# Altium schematic sheet Sheet1.SchDoc
size A4
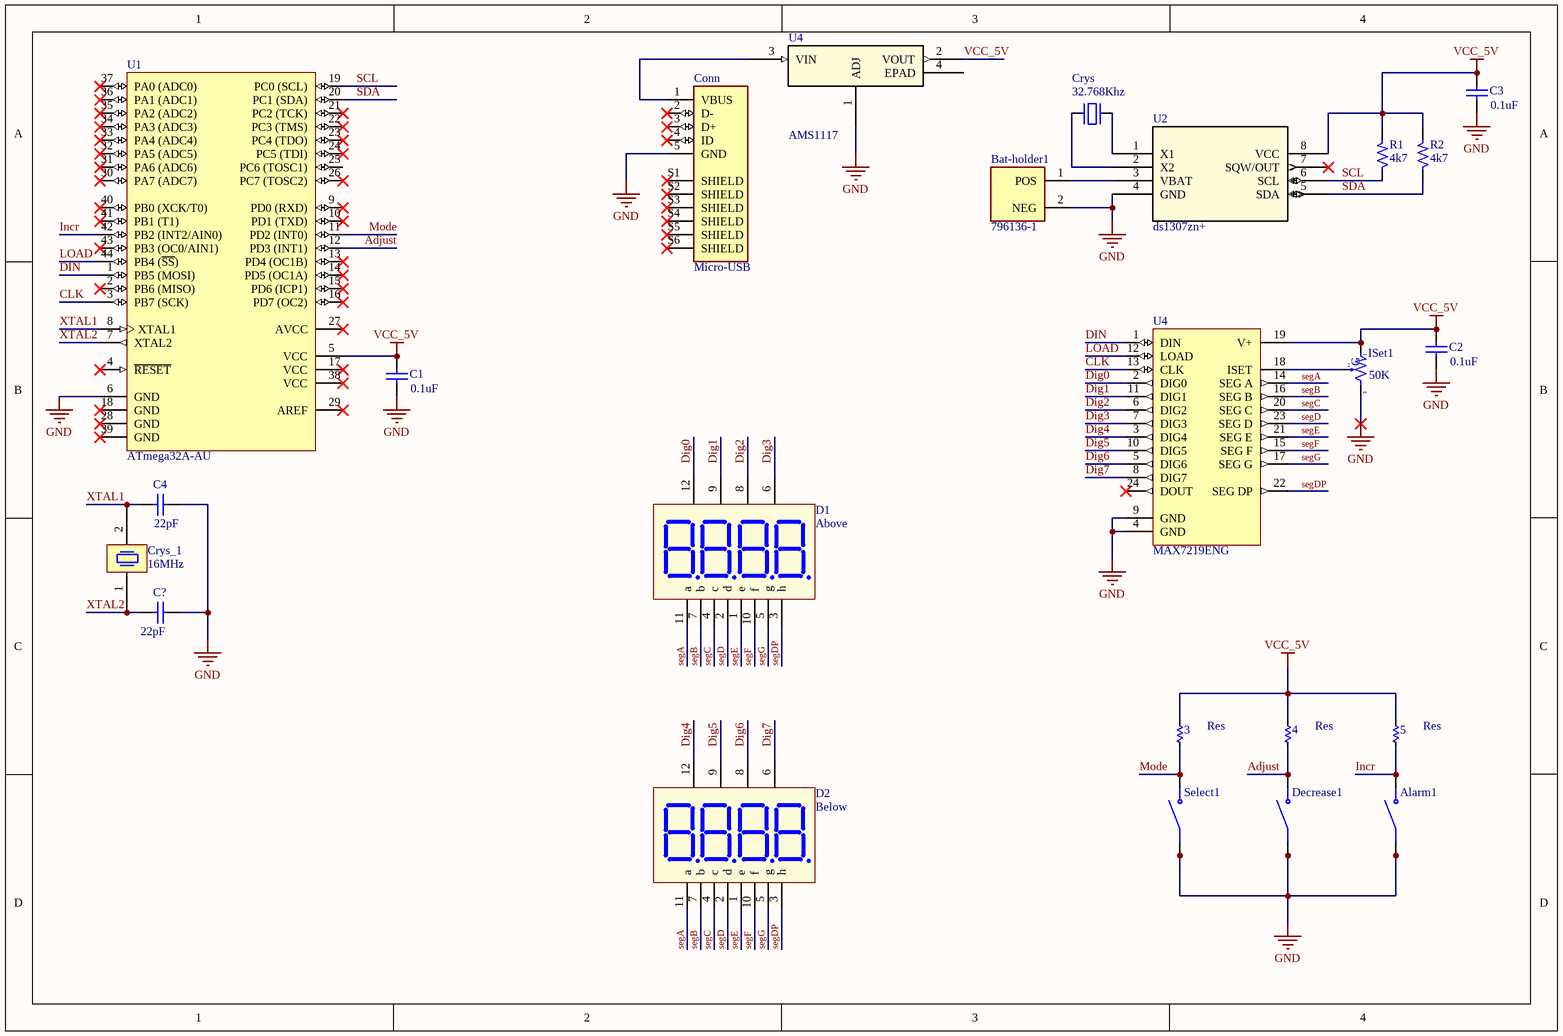
[diagram p0: Sheet1.SchDoc]

## Parts
(Parts that share a designator on the sheet are numbered #1, #2 ... from top to bottom, then left to right.)
3  Res  [RES-SMD-1206]
4  Res  [RES-SMD-1206]
5  Res  [RES-SMD-1206]
Alarm1  1571527-1  [SW_1571527-1]  (value not drawn)
Bat-holder1  796136-1  [TE_796136-1]
C1  0.1uF  [C0805]
C2  0.1uF  [C0805]
C3  0.1uF  [C0805]
C4  22pF  [C0805]
C?  22pF  [C0805]
Conn  Micro-USB  [MOLEX_47346-0001]
Crys  32.768Khz  [XT32k]
Crys_1  16MHz  [ABLS2-8.000MHZ-D4Y-T]
D1  Above  [7SEGQ]
D2  Below  [7SEGQ]
Decrease1  1571527-1  [SW_1571527-1]  (value not drawn)
ISet1  50K  [VR-S1]
R1  4k7  [SM-RES-1206]
R2  4k7  [SM-RES-1206]
Select1  1571527-1  [SW_1571527-1]  (value not drawn)
U1  ATmega32A-AU  [TQFP44]
U2  ds1307zn+  [21-0041B_8_MXM]
U4#1  AMS1117  [SOT_AMS_ADS]
U4#2  MAX7219ENG  [SO24]

## Nets
GND: Alarm1.1(COM) Alarm1.2(COM) Bat-holder1.2(NEG) C1.1 C2.1 C3.1 C4.2 C?.2 Conn.5(GND) Decrease1.1(COM) Decrease1.2(COM) ISet1.3 Select1.1(COM) Select1.2(COM) U1.6(GND) U2.4(GND) U4#1.1(ADJ) U4#2.4(GND) U4#2.9(GND)
VCC_5V: 3.1 4.1 5.1 C1.2 C2.2 C3.2 ISet1.1 R1.2 R2.2 U1.5(VCC) U2.8(VCC) U4#1.2(VOUT) U4#2.19(V+)
Adjust: 4.2 Decrease1.3(NO) Decrease1.4(NO) U1.12(PD3_(INT1))
CLK: U1.3(PB7_(SCK)) U4#2.13(CLK)
Dig0: D1.12(V1) U4#2.2(DIG0)
Dig1: D1.9(V2) U4#2.11(DIG1)
Dig2: D1.8(V3) U4#2.6(DIG2)
Dig3: D1.6(V4) U4#2.7(DIG3)
Dig4: D2.12(V1) U4#2.3(DIG4)
Dig5: D2.9(V2) U4#2.10(DIG5)
Dig6: D2.8(V3) U4#2.5(DIG6)
Dig7: D2.6(V4) U4#2.8(DIG7)
DIN: U1.1(PB5_(MOSI)) U4#2.1(DIN)
Incr: 5.2 Alarm1.3(NO) Alarm1.4(NO) U1.42(PB2_(INT2/AIN0))
LOAD: U1.44(PB4_(~{SS})) U4#2.12(LOAD)
Mode: 3.2 Select1.3(NO) Select1.4(NO) U1.11(PD2_(INT0))
SCL: R1.1 U1.19(PC0_(SCL)) U2.6(SCL)
SDA: R2.1 U1.20(PC1_(SDA)) U2.5(SDA)
segA: D1.11(a) D2.11(a) U4#2.14(SEG_A)
segB: D1.7(b) D2.7(b) U4#2.16(SEG_B)
segC: D1.4(c) D2.4(c) U4#2.20(SEG_C)
segD: D1.2(d) D2.2(d) U4#2.23(SEG_D)
segDP: D1.3(h) D2.3(h) U4#2.22(SEG_DP)
segE: D1.1(e) D2.1(e) U4#2.21(SEG_E)
segF: D1.10(f) D2.10(f) U4#2.15(SEG_F)
segG: D1.5(g) D2.5(g) U4#2.17(SEG_G)
XTAL1: C4.1 Crys_1.2 U1.8(XTAL1)
XTAL2: C?.1 Crys_1.1 U1.7(XTAL2)
NetBat-holder1_1: Bat-holder1.1(POS) U2.3(VBAT)
NetConn_1: Conn.1(VBUS) U4#1.3(VIN)
NetCrys_1: Crys.1 U2.2(X2)
NetCrys_2: Crys.2 U2.1(X1)
NetISet1_2: ISet1.2 U4#2.18(ISET)

Not connected (* = marked no-connect by the designer): Conn 2(D-)* 3(D+)* 4(ID)* S1(SHIELD)* S2(SHIELD)* S3(SHIELD)* S4(SHIELD)* S5(SHIELD)* S6(SHIELD)*; U1 2(PB6_(MISO))* 4(~{RESET})* 9(PD0_(RXD))* 10(PD1_(TXD))* 13(PD4_(OC1B))* 14(PD5_(OC1A))* 15(PD6_(ICP1))* 16(PD7_(OC2))* 17(VCC)* 18(GND)* 21(PC2_(TCK))* 22(PC3_(TMS))* 23(PC4_(TDO))* 24(PC5_(TDI))* 25(PC6_(TOSC1)) 26(PC7_(TOSC2))* 27(AVCC)* 28(GND)* 29(AREF)* 30(PA7_(ADC7))* 31(PA6_(ADC6))* 32(PA5_(ADC5))* 33(PA4_(ADC4))* 34(PA3_(ADC3))* 35(PA2_(ADC2))* 36(PA1_(ADC1))* 37(PA0_(ADC0))* 38(VCC)* 39(GND)* 40(PB0_(XCK/T0))* 41(PB1_(T1))* 43(PB3_(OC0/AIN1))*; U2 7(SQW/OUT)*; U4#1 4(EPAD); U4#2 24(DOUT)*

## Notes on the sheet
- (in symbol VR-S) G

## Library data of the parts
3-5 = Res-SMD: Resistor; Manufacturer: Generic Components; Class: Passive; Published: 08/06/2000; Publisher: Altium Hobart Technology Centre
Alarm1 Decrease1 Select1 = 1571527-1: Switch Tactile OFF _ON_ Round Button Gull Wing 0.05A 12VDC 0.98N SMD Bulk; MF: TE Connectivity; MP: 1571527-1; EU_RoHS_Compliance: Compliant; SnapEDA_Link: https://www.snapeda.com/parts/1571527-1/TE%20Connectivity/view-part/244428/?ref=snap; Price: None; Package: SMD-6 Omron Electronics; Availability: Unavailable; TE_purchase_URL: https://www.te.com/usa-en/product-1571527-1.html?te_bu=Cor&te_type=disp&te_campaign=seda_glo_cor-seda-global-disp-prtnr-fy19-seda-model-bom-cta_sma-317_1&elqCampaignId=32493; Value: *
Bat-holder1 = 796136-1: BATTERY HOLDER; No. of Batteries:1; Terminal Type:Surface Mount; For Use With:CR2032 Batteries; Accessory Type:Battery Holder; Battery Size Code:2032; Number_of_Positions: 2; MF: TE Connectivity; Package: None; Value: *; TE_purchase_URL: https://www.te.com/usa-en/product-796136-1.html?te_bu=Cor&te_type=disp&te_campaign=seda_glo_cor-seda-global-disp-prtnr-fy19-seda-model-bom-cta_sma-317_1&elqCampaignId=32493; EU_RoHS_Compliance: Compliant; SnapEDA_Link: https://www.snapeda.com/parts/796136-1/TE%20Connectivity%20AMP%20Connectors/view-part/761452/?ref=snap; Availability: Unavailable; Price: None; MP: 796136-1
C1-C4 C? = CapSMD: Capacitor; Value: 33p; Published: 8-Jun-2000; LatestRevisionDate: 17-Jul-2002; LatestRevisionNote: Re-released for DXP Platform.; PackageReference: RAD-0.3; Publisher: Altium Limited
Conn = 47346-0001: USB Connectors MICRO USB B RECPT BTTM MOUNT ASSY; MF: Molex; Package: None; MP: 47346-0001; Purchase-URL: https://pricing.snapeda.com/search/part/47346-0001/?ref=eda; Check_prices: https://www.snapeda.com/parts/47346-0001/Molex/view-part/53503/?ref=eda; Value: *; Availability: Warning; Price: None; SnapEDA_Link: https://www.snapeda.com/parts/47346-0001/Molex/view-part/53503/?ref=snap
Crys = XT2: Crystal, 32.768 KHz, -40 to 85 degC, 3.2 x 1.5 x 0.9 mm SMD; Value: 4Mhz
Crys_1 = ABLS2-8.000MHZ-D4Y-T: Crystal, 8 MHz, SMD, 11.4mm x 4.7mm, 30 ppm, 18 pF, 30 ppm, ABLS2 Series; Manufacturer: ABRACON; Value: 8MHz; Component Type: Crystal; Manufacturer Part No: ABLS2-8.000MHZ-D4Y-T; Order Code: *; Supplier: *
D1 D2 = LED7Q: Four 7 Seg Dipslay; Value: LED 7Q SEG
ISet1 = VR-S: Var Resistor; Value: Volume 50k
R1 R2 = R: Resistor 1/4W; Value: R1/4W - 1K
U1 = ATmega32A-AU: 8/16-bit AVR XMEGA A4 Microcontroller, 1.6-3.6V, 32KB + 4KB Flash, 1KB EEPROM, 4KB SRAM, 44-pin TQFP, Industrial Grade (-40°C to 85°C), Pb-Free; Published: 1-Apr-2010; DatasheetVersion: revN, Feb-2010; PackageVersion: rev.B, Oct-2001; PackageReference: 44A; Publisher: Altium Limited; PackageDescription: 44-Pin Plastic Thin Profile Quad Flat Pack, 10 x 10 x 1.0 mm Body, 0.8 mm Pitch (TQFP); Supplier 1: Digi-Key; Supplier Part Number 1: ATXMEGA32A4-AU-ND; Supplier 2: Farnell; Supplier Part Number 2: 1748557; Supplier 3: Mouser; Supplier Part Number 3: 556-ATXMEGA32A4-AU; ComponentLink1Description: Manufacturer Link; ComponentLink1URL: http://www.atmel.com/products/avr/default.asp?; ComponentLink2Description: ATxmega16A4/32A4/64A4/128A4 Datasheet; ComponentLink2URL: http://www.atmel.com/dyn/resources/prod_documents/doc8069.pdf; ComponentLink3Description: Atmel.com Home; ComponentLink3URL: http://www.atmel.com
U2 = ds1307zn+: No Description Available; Mfr_Name: Maxim Integrated Products; Copyright: Copyright (C) 2021 Ultra Librarian. All rights reserved.; Manufacturer_Part_Number: ds1307zn+; RefDes: RefDes; Type: DEV
U4#1 = AMS1117: No Description Available; Vendor: Advanced Monolithic Systems; Built_By: EMA_Matt; SourceLibrary: Advanced_Monolithic_Systems_10-16-2019; Copyright: Copyright (C) 2018 Accelerated Designs. All rights reserved; Manufacturer_Part_Number: AMS1117; RefDes: RefDes; Type: DEV
U4#2 = MAX7219ENG: Serially Interfaced, 8-Digit LED Display Driver; Published: 16-Jan-2001; LatestRevisionDate: 29-May-2009; LatestRevisionNote: Component Body Added.; DatasheetVersion: Jul-1997; PackageVersion: 1997; PackageReference: NG24A; Publisher: Altium Limited; PackageDescription: DIP, 24-Pin, Row Spacing 7.62 mm, Pitch 2.54 mm; Code_JEDEC: MS-001-AF; ComponentLink1Description: Manufacturer Link; ComponentLink1URL: http://www.maxim-ic.com/; ComponentLink2Description: Datasheet; ComponentLink2URL: http://pdfserv.maxim-ic.com/en/ds/MAX7219-MAX7221.pdf